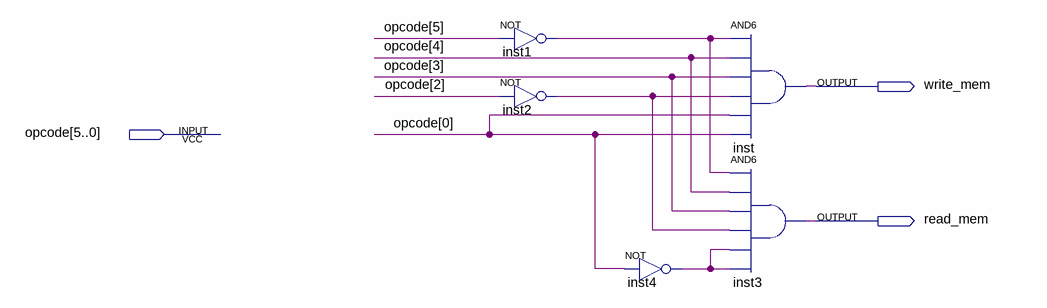
[diagram p0: schematic sheet]
// Quartus schematic memWRsg.bdf as structural Verilog: 5 symbols, 3 pins
module memWRsg (
  input  [5:0] opcode,
  output write_mem,
  output read_mem
);

  wire inst1_out, inst2_out, inst4_out;

  not inst1 (inst1_out, opcode[5]);
  not inst2 (inst2_out, opcode[2]);
  not inst4 (inst4_out, opcode[0]);
  and inst (write_mem, inst1_out, opcode[4], opcode[3], inst2_out, opcode[0], opcode[0]);
  and inst3 (read_mem, inst1_out, opcode[4], opcode[3], inst2_out, inst4_out, inst4_out);
endmodule
